# Altium schematic sheet Open Reactor Control System - Overview.SchDoc: ORC - Overview
size A3; Author: Peake J; CompanyName: Scion Research; DrawnBy: Peake J; Engineer: Peake J; Organization: Scion; Address1: 49 Sala St; Address2: Whakarewarewa; Address3: Rotorua; Address4: New Zealand 3010; DocumentNumber: 0-1; Revision: 0; SheetNumber: 1; SheetTotal: 6
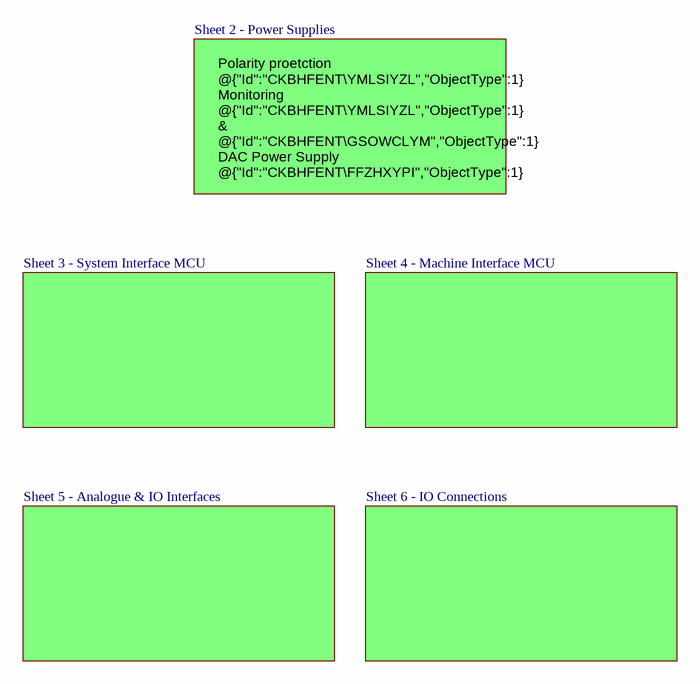
[diagram p0: Open Reactor Control System - Overview.SchDoc]

## Sub-sheets
Sheet 2 - Power Supplies = Open Reactor Control System - Power Supplies.SchDoc: no entries
Sheet 3 - System Interface MCU = Open Reactor Control System - System Interface MCU.SchDoc: no entries
Sheet 4 - Machine Interface MCU = Open Reactor Control System - Machine Interface MCU.SchDoc: no entries
Sheet 5 - Analogue & IO Interfaces = Open Reactor Control System - Analogue & IO Interfaces.SchDoc: no entries
Sheet 6 - IO Connections = Open Reactor Control System - IO Connections.SchDoc: no entries

## Notes on the sheet
- Polarity proetction          @{"Id":"CKBHFENT\YMLSIYZL","ObjectType":1}
  Monitoring @{"Id":"CKBHFENT\YMLSIYZL","ObjectType":1} &  @{"Id":"CKBHFENT\GSOWCLYM","ObjectType":1}
  DAC Power Supply        @{"Id":"CKBHFENT\FFZHXYPI","ObjectType":1}
  Main system supply       @{"Id":"CKBHFENT\AOZTTEXN","ObjectType":1}
  Main digital supply         @{"Id":"HUXZWCFM\SRGIFRCU","ObjectType":1}
  Main analogue supply    @{"Id":"GRLKQKBX\CPZLBXXP","ObjectType":1}
  Ethernet analogue supply @{"Id":"CCWINLET\BSVYVINI","ObjectType":1}
  Analogue reference        @{"Id":"CKBHFENT\XIQHEIHK","ObjectType":1}
- Title
- Size:
- Date:
- A3
- Number:
- Time:
- Revision:
- Sheet
- of
- File: